# Altium schematic sheet LED.SchDoc
size A; SheetNumber: 1; SheetTotal: 2
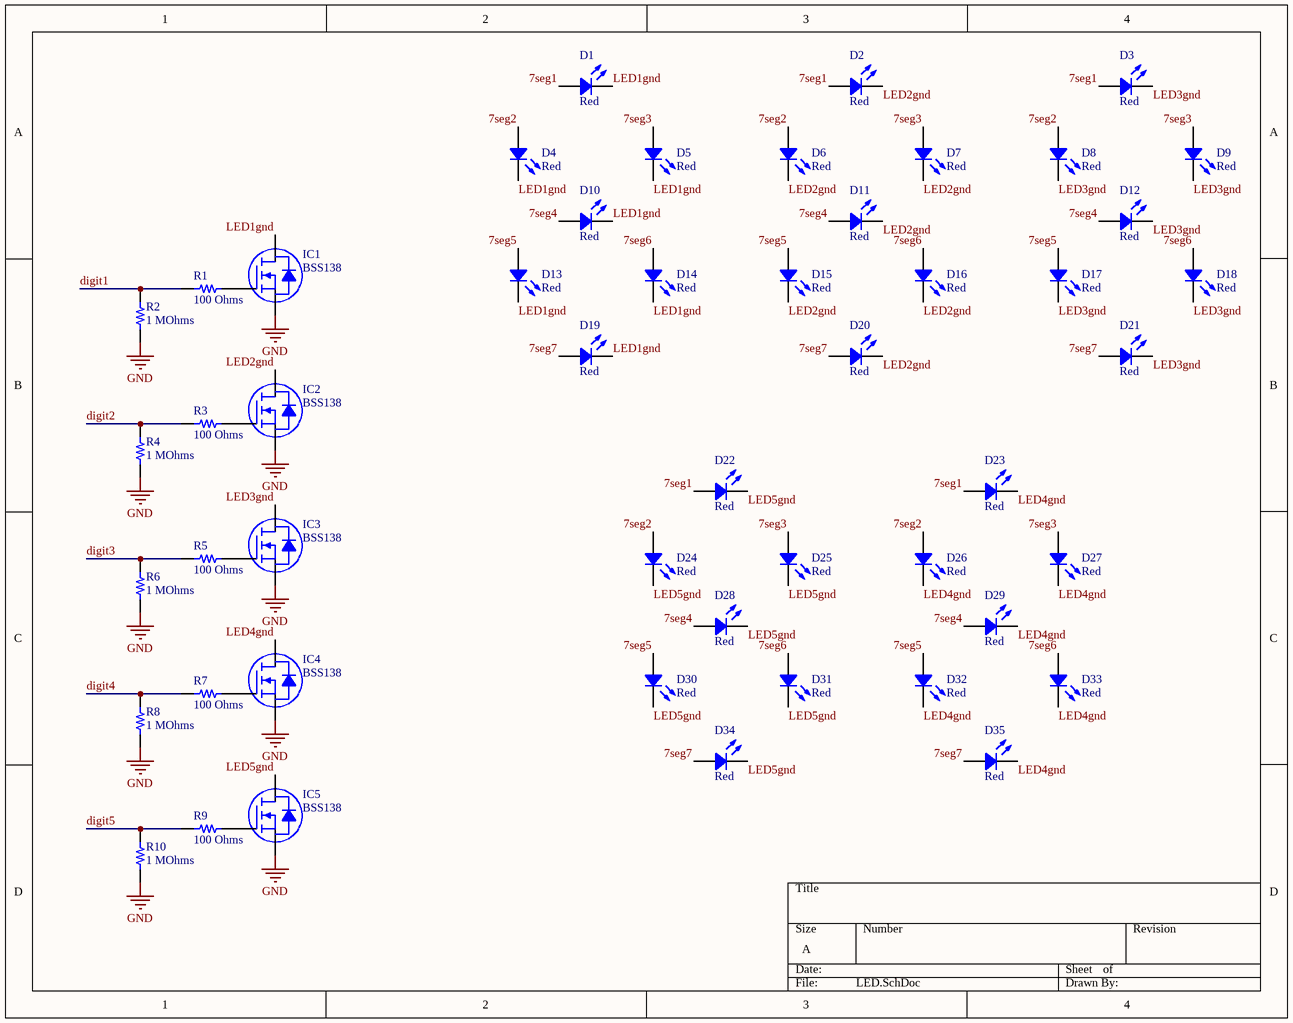
[diagram p0: LED.SchDoc]

## Parts
D1  Red  [LED 0805_2012 RED]
D2  Red  [LED 0805_2012 RED]
D3  Red  [LED 0805_2012 RED]
D4  Red  [LED 0805_2012 RED]
D5  Red  [LED 0805_2012 RED]
D6  Red  [LED 0805_2012 RED]
D7  Red  [LED 0805_2012 RED]
D8  Red  [LED 0805_2012 RED]
D9  Red  [LED 0805_2012 RED]
D10  Red  [LED 0805_2012 RED]
D11  Red  [LED 0805_2012 RED]
D12  Red  [LED 0805_2012 RED]
D13  Red  [LED 0805_2012 RED]
D14  Red  [LED 0805_2012 RED]
D15  Red  [LED 0805_2012 RED]
D16  Red  [LED 0805_2012 RED]
D17  Red  [LED 0805_2012 RED]
D18  Red  [LED 0805_2012 RED]
D19  Red  [LED 0805_2012 RED]
D20  Red  [LED 0805_2012 RED]
D21  Red  [LED 0805_2012 RED]
D22  Red  [LED 0805_2012 RED]
D23  Red  [LED 0805_2012 RED]
D24  Red  [LED 0805_2012 RED]
D25  Red  [LED 0805_2012 RED]
D26  Red  [LED 0805_2012 RED]
D27  Red  [LED 0805_2012 RED]
D28  Red  [LED 0805_2012 RED]
D29  Red  [LED 0805_2012 RED]
D30  Red  [LED 0805_2012 RED]
D31  Red  [LED 0805_2012 RED]
D32  Red  [LED 0805_2012 RED]
D33  Red  [LED 0805_2012 RED]
D34  Red  [LED 0805_2012 RED]
D35  Red  [LED 0805_2012 RED]
IC1  BSS138  [ON SEMI SOT-23-3]
IC2  BSS138  [ON SEMI SOT-23-3]
IC3  BSS138  [ON SEMI SOT-23-3]
IC4  BSS138  [ON SEMI SOT-23-3]
IC5  BSS138  [ON SEMI SOT-23-3]
R1  100 Ohms  [RES 0805_2012]
R2  1 MOhms  [RES 0805_2012]
R3  100 Ohms  [RES 0805_2012]
R4  1 MOhms  [RES 0805_2012]
R5  100 Ohms  [RES 0805_2012]
R6  1 MOhms  [RES 0805_2012]
R7  100 Ohms  [RES 0805_2012]
R8  1 MOhms  [RES 0805_2012]
R9  100 Ohms  [RES 0805_2012]
R10  1 MOhms  [RES 0805_2012]

## Nets
GND: IC1.2(S) IC2.2(S) IC3.2(S) IC4.2(S) IC5.2(S) R2.1 R4.1 R6.1 R8.1 R10.1
7seg1: D1.1 D2.1 D3.1 D22.1 D23.1
7seg2: D4.1 D6.1 D8.1 D24.1 D26.1
7seg3: D5.1 D7.1 D9.1 D25.1 D27.1
7seg4: D10.1 D11.1 D12.1 D28.1 D29.1
7seg5: D13.1 D15.1 D17.1 D30.1 D32.1
7seg6: D14.1 D16.1 D18.1 D31.1 D33.1
7seg7: D19.1 D20.1 D21.1 D34.1 D35.1
digit1: R1.1 R2.2
digit2: R3.1 R4.2
digit3: R5.1 R6.2
digit4: R7.1 R8.2
digit5: R9.1 R10.2
LED1gnd: D1.2 D4.2 D5.2 D10.2 D13.2 D14.2 D19.2 IC1.3(D)
LED2gnd: D2.2 D6.2 D7.2 D11.2 D15.2 D16.2 D20.2 IC2.3(D)
LED3gnd: D3.2 D8.2 D9.2 D12.2 D17.2 D18.2 D21.2 IC3.3(D)
LED4gnd: D23.2 D26.2 D27.2 D29.2 D32.2 D33.2 D35.2 IC4.3(D)
LED5gnd: D22.2 D24.2 D25.2 D28.2 D30.2 D31.2 D34.2 IC5.3(D)
NetIC1_1: IC1.1(G) R1.2
NetIC2_1: IC2.1(G) R3.2
NetIC3_1: IC3.1(G) R5.2
NetIC4_1: IC4.1(G) R7.2
NetIC5_1: IC5.1(G) R9.2

## Library data of the parts
D1-D35 = SML-LXT0805SRW-TR: LED RED DIFFUSED SMD; Manufacturer: Lumex Opto/Components Inc.; Configuration: Standard; Current - Test: 20mA; Lens Color: White; Lens Size: 1.30mm x 1.25mm; Lens Style: Rectangle with Flat Top; Millicandela Rating: 21mcd; Viewing Angle: 140°; Voltage - Forward (Vf) (Typ): 1.8V; Wavelength - Peak: 660nm; Part Number: SML-LXT0805SRW-TR; Color: Red; ComponentLink1Description: Datasheet; ComponentLink1URL: https://www.lumex.com/content/files/ProductAttachment/SML-LXT0805SRW-TR.pdf; ComponentLink2Description: DigiKey Link; ComponentLink2URL: http://digikey.com/product-detail/en/lumex-opto-components-inc/SML-LXT0805SRW-TR/67-1555-1-ND/304372; Device Package: 0805 (2012 Metric); Height (Max): 0.80mm; LastUpdated: 9/2/2020 1:21:01 AM; Lens Transparency: Diffused; Lifecycle Status: Active; Minimum Order: 1; Mounting Type: Surface Mount; Package / Case: 0805 (2012 Metric); Packaging: TapeAndReel; PartId: 311; Part Status: Active; Price: 0.07; Series: -; Size / Dimension: 2.00mm L x 1.25mm W; Supplier 1: DigiKey; Supplier Part Number 1: 67-1555-1-ND; Value: Red
IC1-IC5 = BSS138: MOSFET N-CH 50V 220MA SOT-23; Manufacturer: ON Semiconductor; Current - Continuous Drain (Id) @ 25°C: 220mA (Ta); Drive Voltage (Max Rds On,  Min Rds On): 4.5V, 10V; FET Type: N-Channel; Gate Charge (Qg) (Max) @ Vgs: 2.4nC @ 10V; Input Capacitance (Ciss) (Max) @ Vds: 27pF @ 25V; Power Dissipation (Max): 360mW (Ta); Rds On (Max) @ Id, Vgs: 3.5Ohm @ 220mA, 10V; Vgs (Max): ±20V; Vgs(th) (Max) @ Id: 1.5V @ 1mA; Part Number: BSS138; ComponentLink1Description: Datasheet; ComponentLink1URL: https://www.onsemi.com/pub/Collateral/BSS138-D.PDF; ComponentLink2Description: DigiKey Link; ComponentLink2URL: http://digikey.com/product-detail/en/on-semiconductor/BSS138/BSS138CT-ND/244294; Drain to Source Voltage (Vdss): 50V; LastUpdated: 9/2/2020 1:25:08 AM; Lifecycle Status: Active; Minimum Order: 1; Mounting Type: Surface Mount; Operating Temperature: -55°C ~ 150°C (TJ); Package / Case: TO-236-3, SC-59, SOT-23-3; Packaging: TapeAndReel; Part Status: Active; Price: 0.05; Series: -; Supplier 1: DigiKey; Supplier Part Number 1: BSS138CT-ND; Supplier Device Package: SOT-23-3; Technology: MOSFET (Metal Oxide)
R1 R3 R5 R7 R9 = RCS0805100RFKEA: RES SMD 100 OHM 1% 0.4W 0805; Manufacturer: Vishay Dale; Power (Watts): 0.4W, 2/5W; Temperature Coefficient: ±100ppm/°C; Part Number: RCS0805100RFKEA; Value: 100 Ohms; ComponentLink1Description: Datasheet; ComponentLink1URL: http://www.vishay.com/docs/20065/rcse3.pdf; ComponentLink2Description: DigiKey Link; ComponentLink2URL: http://digikey.com/product-detail/en/vishay-dale/RCS0805100RFKEA/541-2834-1-ND/5867127; Composition: Thick Film; Device Package: 0805 (2012 Metric); Features: Automotive AEC-Q200, Pulse Withstanding; Height - Seated (Max): 0.020" (0.50mm); LastUpdated: 9/2/2020 1:15:24 AM; Lifecycle Status: Active; Minimum Order: 1; Number of Terminations: 2; Operating Temperature: -55°C ~ 155°C; Package / Case: 0805 (2012 Metric); Packaging: TapeAndReel; PartId: 27784; Part Status: Active; Price: 0.03; Ratings: AEC-Q200; Resistance: 100 Ohms; Series: RCS e3; Size / Dimension: 0.079" L x 0.049" W (2.00mm x 1.25mm); Supplier 1: DigiKey; Supplier Part Number 1: 541-2834-1-ND; Supplier Device Package: 0805; Tolerance: ±1%
R2 R4 R6 R8 R10 = ERA-6AEB105V: RES 1M OHM 0.1% 1/8W 0805; Manufacturer: Panasonic Electronic Components; Power (Watts): 0.125W, 1/8W; Temperature Coefficient: ±25ppm/°C; Part Number: ERA-6AEB105V; Value: 1 MOhms; ComponentLink1Description: Datasheet; ComponentLink1URL: https://industrial.panasonic.com/cdbs/www-data/pdf/RDM0000/AOA0000C307.pdf; ComponentLink2Description: DigiKey Link; ComponentLink2URL: http://digikey.com/product-detail/en/panasonic-electronic-components/ERA-6AEB105V/P1MDACT-ND/1466019; Composition: Thin Film; Device Package: 0805 (2012 Metric); Features: Automotive AEC-Q200; Height - Seated (Max): 0.024" (0.60mm); LastUpdated: 9/2/2020 1:15:23 AM; Lifecycle Status: Active; Minimum Order: 1; Number of Terminations: 2; Operating Temperature: -55°C ~ 155°C; Package / Case: 0805 (2012 Metric); Packaging: TapeAndReel; PartId: 28069; Part Status: Active; Price: 0.04; Ratings: AEC-Q200; Resistance: 1 MOhms; Series: ERA-6A; Size / Dimension: 0.079" L x 0.049" W (2.00mm x 1.25mm); Supplier 1: DigiKey; Supplier Part Number 1: P1MDACT-ND; Supplier Device Package: 0805; Tolerance: ±0.1%